# Altium schematic sheet LaunchyIgnition.SchDoc: Launchy Ignition Driver
size Letter; Date: 11/14/2017; DrawnBy: George Troulis; Engineer: George Troulis; Organization: Rocket Propulsion Laboratory; DocumentFullPathAndName: XXX; DocumentName: LaunchyIgnition.SchDoc
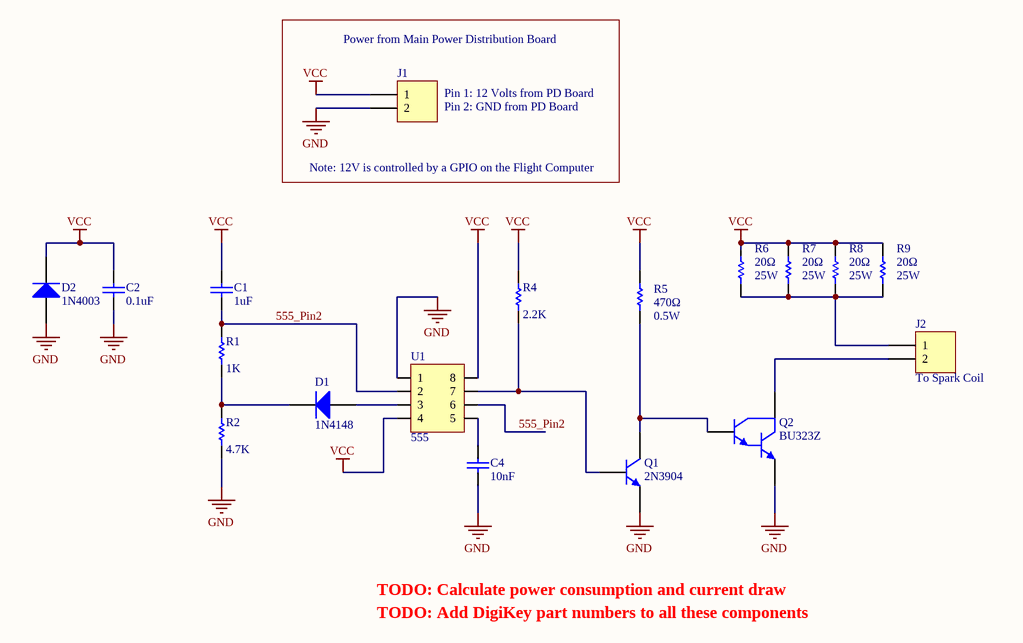
[diagram p0: LaunchyIgnition.SchDoc]

## Parts
C1  value 1uF  [Cap-0805]  (hidden comment: Capacitor)
C2  value 0.1uF  [Cap-0805]  (hidden comment: Capacitor)
C4  value 10nF  [Cap-0805]  (hidden comment: Capacitor)
D1  1N4148  [SOD-123]
D2  1N4003  [DO-41]
J1  Header 2  [WPJ-2]  (value not drawn)
J2  To Spark Coil  [WPJ-2]
Q1  2N3904  [TO-226-AA]
Q2  BU323Z  [TO-92]
R1  value 1K  [Res-0805]  (hidden comment: Res1)
R2  value 4.7K  [Res-0805]  (hidden comment: Res1)
R4  value 2.2K  [Res-0805]  (hidden comment: Res1)
R5  value 470Ω  Max Power: 0.5W  [Res-0805]  (hidden comment: Res1)
R6  value 20Ω  Max Power: 25W  [Res-0805]  (hidden comment: Res1)
R7  value 20Ω  Max Power: 25W  [Res-0805]  (hidden comment: Res1)
R8  value 20Ω  Max Power: 25W  [Res-0805]  (hidden comment: Res1)
R9  value 20Ω  Max Power: 25W  [Res-0805]  (hidden comment: Res1)
U1  555  [8-SOIC]

## Nets
GND: C2.1 C4.1 D2.1(A) J1.2 Q1.3(E) Q2.3(E) R2.1 U1.1
VCC: C1.2 C2.2 D2.2(K) J1.1 R4.2 R5.2 R6.2 R7.2 R8.2 R9.2 U1.4 U1.8
555_Pin2: C1.1 R1.2 U1.2 U1.6
NetC4_2: C4.2 U1.5
NetD1_1: D1.1(A) U1.3
NetD1_2: D1.2(K) R1.1 R2.2
NetJ2_1: J2.1 R6.1 R7.1 R8.1 R9.1
NetJ2_2: J2.2 Q2.1(C)
NetQ1_1: Q1.1(C) Q2.2(B) R5.1
NetQ1_2: Q1.2(B) R4.1 U1.7

## Notes on the sheet
- (near J1) Power from Main Power Distribution Board
- (near J1) Pin 1: 12 Volts from PD Board
- Note: 12V is controlled by a GPIO on the Flight Computer
- (near J1) Pin 2: GND from PD Board
- TODO: Calculate power consumption and current draw
- TODO: Add DigiKey part numbers to all these components
- Title
- Size:
- Date:
- Letter
- Number:
- Time:
- Revision:
- Sheet
- of
- File:

## Library data of the parts
C1 C2 C4 = Cap: Published: 8-Jun-2000; LatestRevisionDate: 17-Jul-2002; LatestRevisionNote: Re-released for DXP Platform.; PackageReference: RAD-0.3; Publisher: Altium Limited; PackageDescription: Radial Cap, Thru-Hole; 2 Leads; 0.3 in Pin Spacing
D1 D2 = Diode 1N4148
J1 J2 = Header 2: Header, 2-Pin
  J1: LatestRevisionDate: 17-Jul-2002; LatestRevisionNote: Re-released for DXP Platform.; Publisher: Altium Limited
Q1 = NPN: NPN Bipolar Transistor; Published: 8-Jun-2000; LatestRevisionDate: 17-Jul-2002; LatestRevisionNote: Re-released for DXP Platform.; PackageReference: TO-226-AA; Publisher: Altium Limited; PackageDescription: TO, Flat Index; 3 In-Line, Axial Leads; Body Dia. 4.8mm; Leads 0.55 x 0.51 mm (max); Code_JEDEC: TO-226-AA
Q2 = NPN1: NPN Darlington Bipolar Transistor; Published: 8-Jun-2000; LatestRevisionDate: 17-Jul-2002; LatestRevisionNote: Re-released for DXP Platform.; DatasheetVersion: 1989; PackageVersion: 1989; PackageReference: TO-92; Publisher: Altium Limited; PackageDescription: TO, Flat Index; 3 In-Line, Axial Leads; Body Dia. 4.6mm; Leads 0.41 x 0.39 mm (max); Code_JEDEC: TO-92
R1 R2 R4-R9 = Res1: Resistor; Published: 8-Jun-2000; LatestRevisionDate: 17-Jul-2002; LatestRevisionNote: Re-released for DXP Platform.; PackageReference: AXIAL-0.3; Publisher: Altium Limited; PackageDescription: Axial Device, Thru-Hole; 2 Leads; 0.3 in Pin Spacing
U1 = 555: IC OSC SGL TIMER 2.1MHZ 8-SOIC; Manufacturer Part Number: TLC555CDR